# Altium schematic sheet ET2_test Chip_V1.SchDoc
size A4
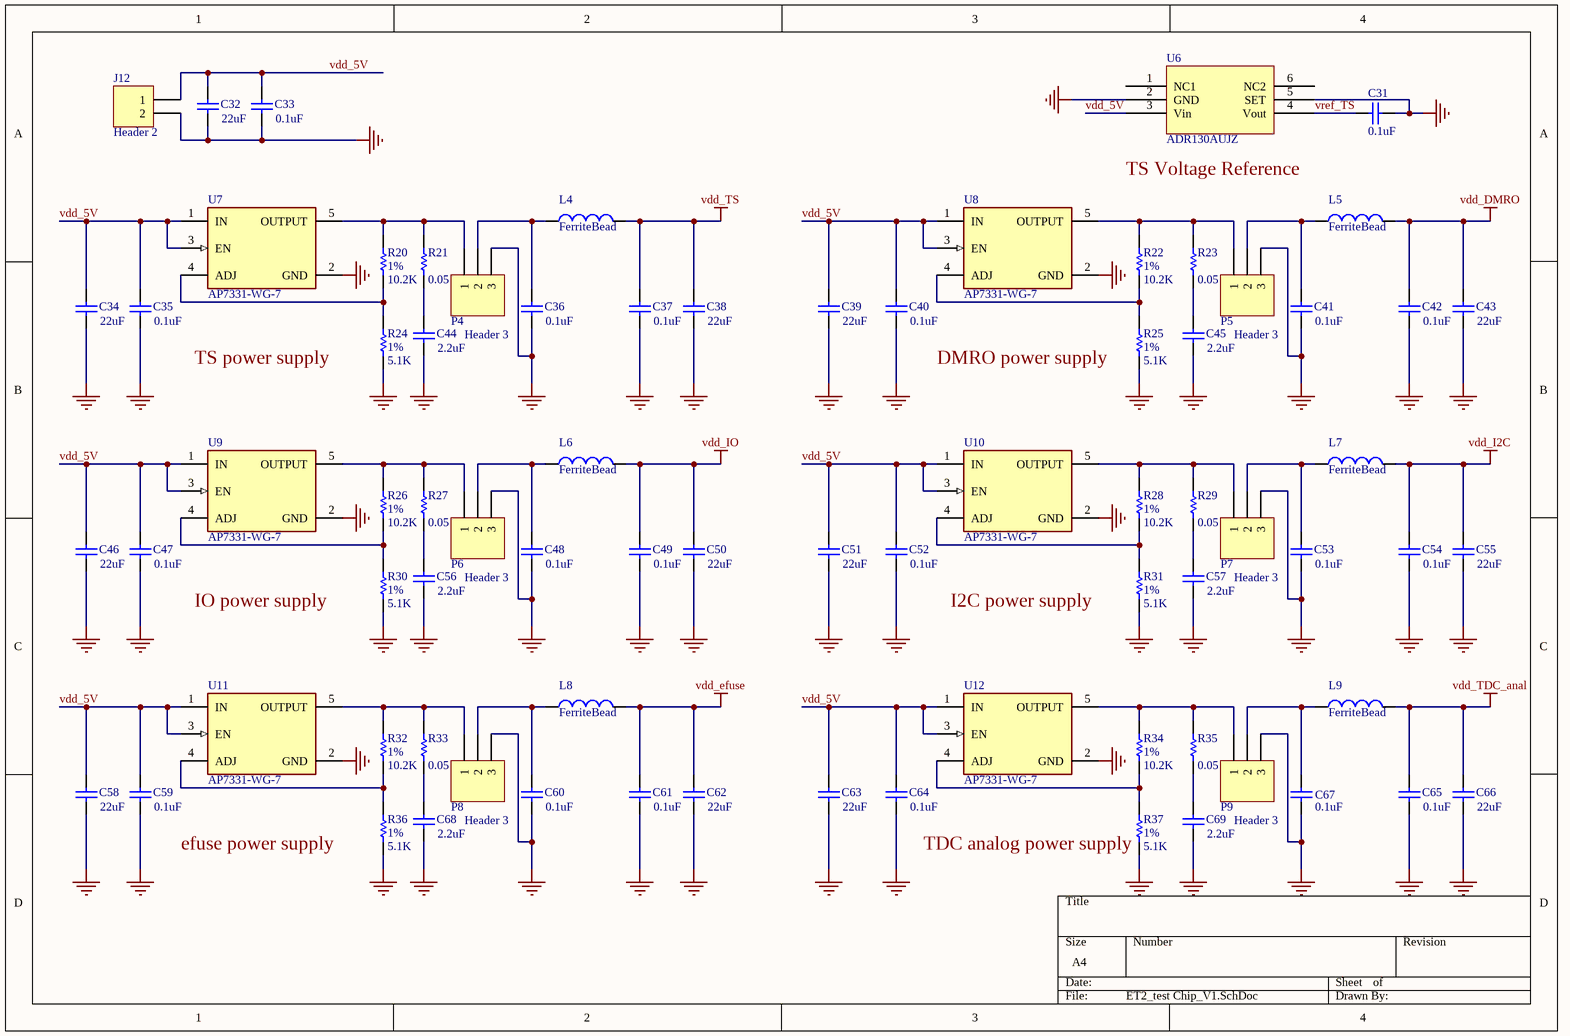
[diagram p0: ET2_test Chip_V1.SchDoc]

## Parts
C31  value 0.1uF  [0402-eagle]  (hidden comment: Cap)
C32  value 22uF  [C1210]  (hidden comment: Cap)
C33  value 0.1uF  [0805-eagle]  (hidden comment: Cap)
C34  value 22uF  [C1210]  (hidden comment: Cap)
C35  value 0.1uF  [0805-eagle]  (hidden comment: Cap)
C36  value 0.1uF  [0805-eagle]  (hidden comment: Cap)
C37  value 0.1uF  [0805-eagle]  (hidden comment: Cap)
C38  value 22uF  [C1210]  (hidden comment: Cap)
C39  value 22uF  [C1210]  (hidden comment: Cap)
C40  value 0.1uF  [0805-eagle]  (hidden comment: Cap)
C41  value 0.1uF  [0805-eagle]  (hidden comment: Cap)
C42  value 0.1uF  [0805-eagle]  (hidden comment: Cap)
C43  value 22uF  [C1210]  (hidden comment: Cap)
C44  value 2.2uF  [0805-eagle]  (hidden comment: Cap)
C45  value 2.2uF  [0805-eagle]  (hidden comment: Cap)
C46  value 22uF  [C1210]  (hidden comment: Cap)
C47  value 0.1uF  [0805-eagle]  (hidden comment: Cap)
C48  value 0.1uF  [0805-eagle]  (hidden comment: Cap)
C49  value 0.1uF  [0805-eagle]  (hidden comment: Cap)
C50  value 22uF  [C1210]  (hidden comment: Cap)
C51  value 22uF  [C1210]  (hidden comment: Cap)
C52  value 0.1uF  [0805-eagle]  (hidden comment: Cap)
C53  value 0.1uF  [0805-eagle]  (hidden comment: Cap)
C54  value 0.1uF  [0805-eagle]  (hidden comment: Cap)
C55  value 22uF  [C1210]  (hidden comment: Cap)
C56  value 2.2uF  [0805-eagle]  (hidden comment: Cap)
C57  value 2.2uF  [0805-eagle]  (hidden comment: Cap)
C58  value 22uF  [C1210]  (hidden comment: Cap)
C59  value 0.1uF  [0805-eagle]  (hidden comment: Cap)
C60  value 0.1uF  [0805-eagle]  (hidden comment: Cap)
C61  value 0.1uF  [0805-eagle]  (hidden comment: Cap)
C62  value 22uF  [C1210]  (hidden comment: Cap)
C63  value 22uF  [C1210]  (hidden comment: Cap)
C64  value 0.1uF  [0805-eagle]  (hidden comment: Cap)
C65  value 0.1uF  [0805-eagle]  (hidden comment: Cap)
C66  value 22uF  [C1210]  (hidden comment: Cap)
C67  value 0.1uF  [0805-eagle]  (hidden comment: Cap)
C68  value 2.2uF  [0805-eagle]  (hidden comment: Cap)
C69  value 2.2uF  [0805-eagle]  (hidden comment: Cap)
J12  Header 2  [PowerJ2]
L4  value FerriteBead  [0805-eagle]  (hidden comment: Inductor)
L5  value FerriteBead  [0805-eagle]  (hidden comment: Inductor)
L6  value FerriteBead  [0805-eagle]  (hidden comment: Inductor)
L7  value FerriteBead  [0805-eagle]  (hidden comment: Inductor)
L8  value FerriteBead  [0805-eagle]  (hidden comment: Inductor)
L9  value FerriteBead  [0805-eagle]  (hidden comment: Inductor)
P4  Header 3  [Header3_L]
P5  Header 3  [Header3_L]
P6  Header 3  [Header3_L]
P7  Header 3  [Header3_L]
P8  Header 3  [Header3_L]
P9  Header 3  [Header3_L]
R20  1%  value 10.2K  [0402-eagle]
R21  value 0.05  [0402-eagle]  (hidden comment: 1%)
R22  1%  value 10.2K  [0402-eagle]
R23  value 0.05  [0402-eagle]  (hidden comment: 1%)
R24  1%  value 5.1K  [0402-eagle]
R25  1%  value 5.1K  [0402-eagle]
R26  1%  value 10.2K  [0402-eagle]
R27  value 0.05  [0402-eagle]  (hidden comment: 1%)
R28  1%  value 10.2K  [0402-eagle]
R29  value 0.05  [0402-eagle]  (hidden comment: 1%)
R30  1%  value 5.1K  [0402-eagle]
R31  1%  value 5.1K  [0402-eagle]
R32  1%  value 10.2K  [0402-eagle]
R33  value 0.05  [0402-eagle]  (hidden comment: 1%)
R34  1%  value 10.2K  [0402-eagle]
R35  value 0.05  [0402-eagle]  (hidden comment: 1%)
R36  1%  value 5.1K  [0402-eagle]
R37  1%  value 5.1K  [0402-eagle]
U6  ADR130AUJZ  [ADR130]
U7  AP7331-WG-7  [FP-SOT25-MFG]
U8  AP7331-WG-7  [FP-SOT25-MFG]
U9  AP7331-WG-7  [FP-SOT25-MFG]
U10  AP7331-WG-7  [FP-SOT25-MFG]
U11  AP7331-WG-7  [FP-SOT25-MFG]
U12  AP7331-WG-7  [FP-SOT25-MFG]

## Nets
GND: C31.1 C32.1 C33.1 C34.1 C35.1 C36.1 C37.1 C38.1 C39.1 C40.1 C41.1 C42.1 C43.1 C44.1 C45.1 C46.1 C47.1 C48.1 C49.1 C50.1 C51.1 C52.1 C53.1 C54.1 C55.1 C56.1 C57.1 C58.1 C59.1 C60.1 C61.1 C62.1 C63.1 C64.1 C65.1 C66.1 C67.1 C68.1 C69.1 J12.2 P4.3 P5.3 P6.3 P7.3 P8.3 P9.3 R24.1 R25.1 R30.1 R31.1 R36.1 R37.1 U6.2(GND) U6.5(SET) U7.2(GND) U8.2(GND) U9.2(GND) U10.2(GND) U11.2(GND) U12.2(GND)
vdd_DMRO: C42.2 C43.2 L5.2
vdd_efuse: C61.2 C62.2 L8.2
vdd_I2C: C54.2 C55.2 L7.2
vdd_IO: C49.2 C50.2 L6.2
vdd_TDC_anal: C65.2 C66.2 L9.2
vdd_TS: C37.2 C38.2 L4.2
vdd_5V: C32.2 C33.2 C34.2 C35.2 C39.2 C40.2 C46.2 C47.2 C51.2 C52.2 C58.2 C59.2 C63.2 C64.2 J12.1 U6.3(Vin) U7.1(IN) U7.3(EN) U8.1(IN) U8.3(EN) U9.1(IN) U9.3(EN) U10.1(IN) U10.3(EN) U11.1(IN) U11.3(EN) U12.1(IN) U12.3(EN)
vref_TS: C31.2 U6.4(Vout)
NetC36_2: C36.2 L4.1 P4.2
NetC41_2: C41.2 L5.1 P5.2
NetC44_2: C44.2 R21.1
NetC45_2: C45.2 R23.1
NetC48_2: C48.2 L6.1 P6.2
NetC53_2: C53.2 L7.1 P7.2
NetC56_2: C56.2 R27.1
NetC57_2: C57.2 R29.1
NetC60_2: C60.2 L8.1 P8.2
NetC67_2: C67.2 L9.1 P9.2
NetC68_2: C68.2 R33.1
NetC69_2: C69.2 R35.1
NetP4_1: P4.1 R20.2 R21.2 U7.5(OUTPUT)
NetP5_1: P5.1 R22.2 R23.2 U8.5(OUTPUT)
NetP6_1: P6.1 R26.2 R27.2 U9.5(OUTPUT)
NetP7_1: P7.1 R28.2 R29.2 U10.5(OUTPUT)
NetP8_1: P8.1 R32.2 R33.2 U11.5(OUTPUT)
NetP9_1: P9.1 R34.2 R35.2 U12.5(OUTPUT)
NetR20_1: R20.1 R24.2 U7.4(ADJ)
NetR22_1: R22.1 R25.2 U8.4(ADJ)
NetR26_1: R26.1 R30.2 U9.4(ADJ)
NetR28_1: R28.1 R31.2 U10.4(ADJ)
NetR32_1: R32.1 R36.2 U11.4(ADJ)
NetR34_1: R34.1 R37.2 U12.4(ADJ)

Not connected (* = marked no-connect by the designer): U6 1(NC1) 6(NC2)

## Notes on the sheet
- TS Voltage Reference
- TS power supply
- DMRO power supply
- IO power supply
- (near R31) I2C power supply
- (near R36) efuse power supply
- (near R37) TDC analog power supply

## Library data of the parts
C31-C69 = Cap: Capacitor; Published: 8-Jun-2000; LatestRevisionDate: 17-Jul-2002; LatestRevisionNote: Re-released for DXP Platform.; PackageReference: RAD-0.3; Publisher: Altium Limited; PackageDescription: Radial Cap, Thru-Hole; 2 Leads; 0.3 in Pin Spacing
J12 = Header 2: Header, 2-Pin; LatestRevisionDate: 17-Jul-2002; LatestRevisionNote: Re-released for DXP Platform.; Publisher: Altium Limited
L4-L9 = Inductor: Code_IEC: 1005; Published: 8-Jun-2000; LatestRevisionDate: 29-May-2009; LatestRevisionNote: IPC-7351 Footprint Added.; PackageReference: 0402-A; Publisher: Altium Limited; PackageDescription: Chip Inductor; Code_JEITA: 0402
P4-P9 = Header 3: Header, 3-Pin; LatestRevisionDate: 17-Jul-2002; LatestRevisionNote: Re-released for DXP Platform.; Publisher: Altium Limited
R20-R37 = Res1: Resistor; Published: 8-Jun-2000; LatestRevisionDate: 17-Jul-2002; LatestRevisionNote: Re-released for DXP Platform.; PackageReference: AXIAL-0.3; Publisher: Altium Limited; PackageDescription: Axial Device, Thru-Hole; 2 Leads; 0.3 in Pin Spacing
U6 = ADR130
U7-U12 = CMP-12756-000022-1: IC REG LIN POS ADJ 300MA SOT25; Manufacturer: Diodes Inc.; Dropout Voltage: 300mV; Nominal Supply Current: 55-65uA; Standoff Height: 0.013mm; Output Voltage: 0.8-5V; Min Supply Voltage: 2V; Number Of Outputs: 1; Max Supply Voltage: 6V; Output Type: AdjustableProgrammable; Accuracy Percentage: 2%; Max Junction Temp: +150°C; Max Power Dissipation: 640mW; RoHS: TRUE; ComponentLink2URL: https://www.diodes.com/assets/Datasheets/AP7331.pdf; Package: SOT25; Category: IC; Temperature Range Low: -40°C; ComponentLink2Description: Datasheet; Automotive: No; Device Class L3: Voltage Regulators - Linear; Mouser Description: AP7331 Series 0.8 - 5 V ADJ Output 300 mA LDO Linear Regulator - SOT-25; Device Class L2: Power Management ICs; Temperature Range High: +125°C; Lead Free: Yes; Footprint Url: https://www.diodes.com/assets/Package-Files/SOT25.pdf; Manufacturer Part Number: AP7331-WG-7; Device Class L1: Integrated Circuits (ICs); Octopart: https://octopart.com/ap7331-wg-7-diodes+inc.-17930424; Ambient Temperature Range Low: -40°C; Output Current: 300mA; Height: 1.4mm; Ambient Temperature Range High: +85°C; Temperature: -40°C to +125°C; Digikey Description: IC REG LIN POS ADJ 300MA SOT25